# Altium schematic sheet 0095_GBIT LAN - FOXVILLE LAN PHY CHIP.SchDoc
size A3
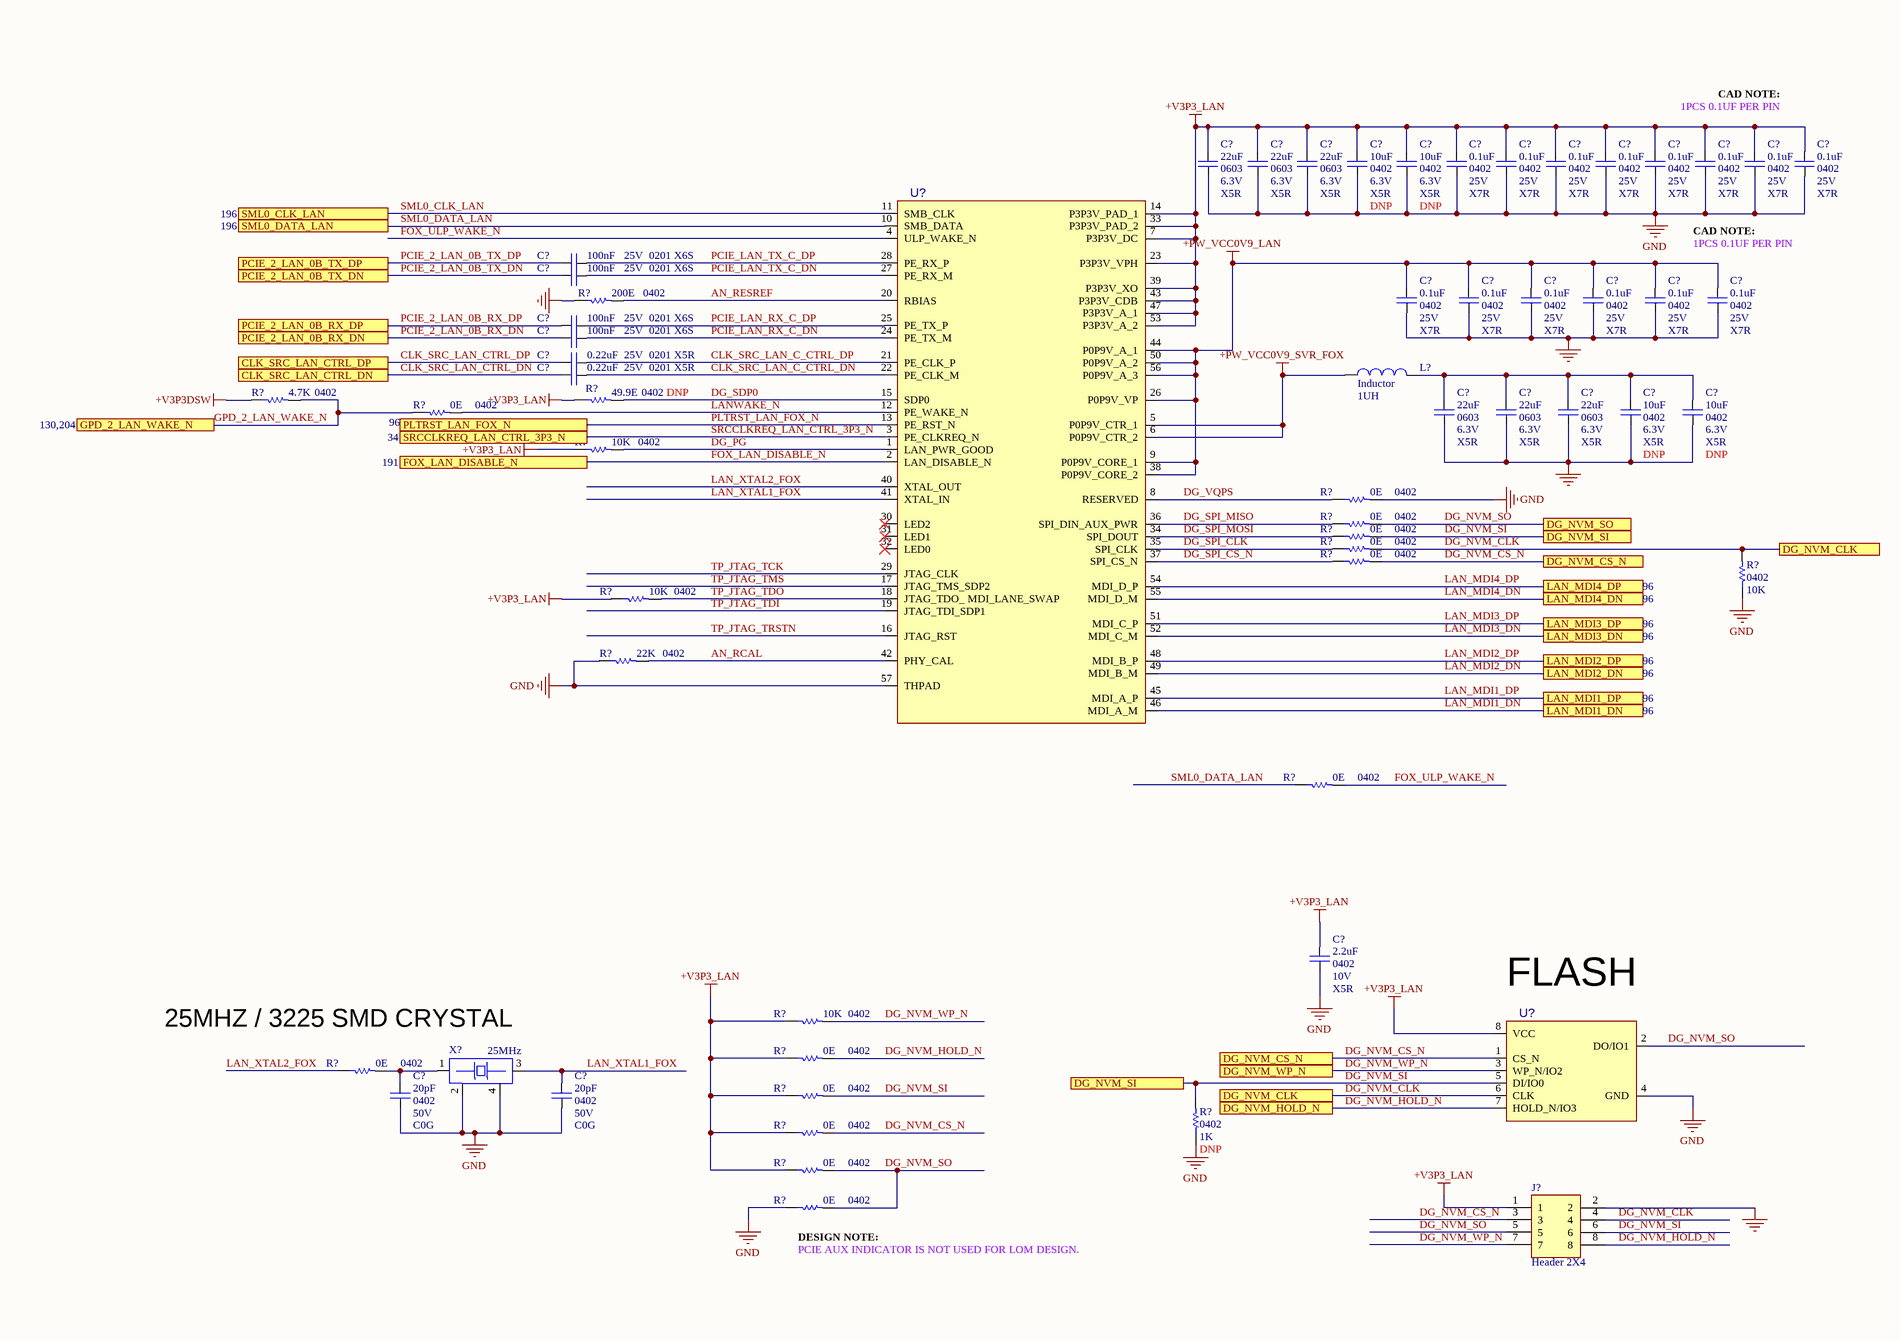
[diagram p0: 0095_GBIT LAN - FOXVILLE LAN PHY CHIP.SchDoc, bottom left]

## Parts
(Parts that share a designator on the sheet are numbered #1, #2 ... from top to bottom, then left to right.)
C?#1  value 22uF  Case/Package: 0603  Voltage: 6.3V  Dielectric: X5R  [CAPC0603]
C?#2  value 22uF  Case/Package: 0603  Voltage: 6.3V  Dielectric: X5R  [CAPC0603]
C?#3  value 22uF  Case/Package: 0603  Voltage: 6.3V  Dielectric: X5R  [CAPC0603]
C?#4  value 10uF  Case/Package: 0402  Voltage: 6.3V  Dielectric: X5R  [CAPC0402]
C?#5  value 10uF  Case/Package: 0402  Voltage: 6.3V  Dielectric: X5R  [CAPC0402]
C?#6  value 0.1uF  Case/Package: 0402  Voltage: 25V  Dielectric: X7R  [CAPC0402]
C?#7  value 0.1uF  Case/Package: 0402  Voltage: 25V  Dielectric: X7R  [CAPC0402]
C?#8  value 0.1uF  Case/Package: 0402  Voltage: 25V  Dielectric: X7R  [CAPC0402]
C?#9  value 0.1uF  Case/Package: 0402  Voltage: 25V  Dielectric: X7R  [CAPC0402]
C?#10  value 0.1uF  Case/Package: 0402  Voltage: 25V  Dielectric: X7R  [CAPC0402]
C?#11  value 0.1uF  Case/Package: 0402  Voltage: 25V  Dielectric: X7R  [CAPC0402]
C?#12  value 0.1uF  Case/Package: 0402  Voltage: 25V  Dielectric: X7R  [CAPC0402]
C?#13  value 0.1uF  Case/Package: 0402  Voltage: 25V  Dielectric: X7R  [CAPC0402]
C?#14  value 100nF  Case/Package: 0201  Voltage: 25V  Dielectric: X6S  [CAPC0201]
C?#15  value 100nF  Case/Package: 0201  Voltage: 25V  Dielectric: X6S  [CAPC0201]
C?#16  value 0.1uF  Case/Package: 0402  Voltage: 25V  Dielectric: X7R  [CAPC0402]
C?#17  value 0.1uF  Case/Package: 0402  Voltage: 25V  Dielectric: X7R  [CAPC0402]
C?#18  value 0.1uF  Case/Package: 0402  Voltage: 25V  Dielectric: X7R  [CAPC0402]
C?#19  value 0.1uF  Case/Package: 0402  Voltage: 25V  Dielectric: X7R  [CAPC0402]
C?#20  value 0.1uF  Case/Package: 0402  Voltage: 25V  Dielectric: X7R  [CAPC0402]
C?#21  value 0.1uF  Case/Package: 0402  Voltage: 25V  Dielectric: X7R  [CAPC0402]
C?#22  value 100nF  Case/Package: 0201  Voltage: 25V  Dielectric: X6S  [CAPC0201]
C?#23  value 100nF  Case/Package: 0201  Voltage: 25V  Dielectric: X6S  [CAPC0201]
C?#24  value 0.22uF  Case/Package: 0201  Voltage: 25V  Dielectric: X5R  [CAPC0201]
C?#25  value 0.22uF  Case/Package: 0201  Voltage: 25V  Dielectric: X5R  [CAPC0201]
C?#26  value 22uF  Case/Package: 0603  Voltage: 6.3V  Dielectric: X5R  [CAPC0603]
C?#27  value 22uF  Case/Package: 0603  Voltage: 6.3V  Dielectric: X5R  [CAPC0603]
C?#28  value 22uF  Case/Package: 0603  Voltage: 6.3V  Dielectric: X5R  [CAPC0603]
C?#29  value 10uF  Case/Package: 0402  Voltage: 6.3V  Dielectric: X5R  [CAPC0402]
C?#30  value 10uF  Case/Package: 0402  Voltage: 6.3V  Dielectric: X5R  [CAPC0402]
C?#31  value 2.2uF  Case/Package: 0402  Voltage: 10V  Dielectric: X5R  [CAPC0402]
C?#32  value 20pF  Case/Package: 0402  Voltage: 50V  Dielectric: C0G  [CAPC0402]
C?#33  value 20pF  Case/Package: 0402  Voltage: 50V  Dielectric: C0G  [CAPC0402]
J?  Header 2X4  [Header 2X4]
L?  Inductor  value 1UH
R?#1  value 200E  Case/Package: 0402  [RESC0402]  (hidden comment: Res)
R?#2  value 4.7K  Case/Package: 0402  [RESC0402]  (hidden comment: Res)
R?#3  value 49.9E  Case/Package: 0402  [RESC0402]  (hidden comment: Res)
R?#4  value 0E  Case/Package: 0402  [RESC0402]  (hidden comment: Res)
R?#5  value 10K  Case/Package: 0402  [RESC0402]  (hidden comment: Res)
R?#6  value 0E  Case/Package: 0402  [RESC0402]  (hidden comment: Res)
R?#7  value 0E  Case/Package: 0402  [RESC0402]  (hidden comment: Res)
R?#8  value 0E  Case/Package: 0402  [RESC0402]  (hidden comment: Res)
R?#9  value 0E  Case/Package: 0402  [RESC0402]  (hidden comment: Res)
R?#10  value 0E  Case/Package: 0402  [RESC0402]  (hidden comment: Res)
R?#11  value 10K  Case/Package: 0402  [RESC0402]  (hidden comment: Res)
R?#12  value 10K  Case/Package: 0402  [RESC0402]  (hidden comment: Res)
R?#13  value 22K  Case/Package: 0402  [RESC0402]  (hidden comment: Res)
R?#14  value 0E  Case/Package: 0402  [RESC0402]  (hidden comment: Res)
R?#15  value 10K  Case/Package: 0402  [RESC0402]  (hidden comment: Res)
R?#16  value 0E  Case/Package: 0402  [RESC0402]  (hidden comment: Res)
R?#17  value 0E  Case/Package: 0402  [RESC0402]  (hidden comment: Res)
R?#18  value 0E  Case/Package: 0402  [RESC0402]  (hidden comment: Res)
R?#19  value 1K  Case/Package: 0402  [RESC0402]  (hidden comment: Res)
R?#20  value 0E  Case/Package: 0402  [RESC0402]  (hidden comment: Res)
R?#21  value 0E  Case/Package: 0402  [RESC0402]  (hidden comment: Res)
R?#22  value 0E  Case/Package: 0402  [RESC0402]  (hidden comment: Res)
U?#1  FOXVILLE_IP  (value not drawn)
U?#2  W25Q16  (value not drawn)
X?  value 25MHz  (hidden comment: CRYSTAL_1)

## Ports
CLK_SRC_LAN_CTRL_DN, CLK_SRC_LAN_CTRL_DP, DG_NVM_CLK, DG_NVM_CS_N, DG_NVM_HOLD_N, DG_NVM_SI, DG_NVM_SO, DG_NVM_WP_N, FOX_LAN_DISABLE_N, GPD_2_LAN_WAKE_N, LAN_MDI1_DN, LAN_MDI1_DP, LAN_MDI2_DN, LAN_MDI2_DP, LAN_MDI3_DN, LAN_MDI3_DP, LAN_MDI4_DN, LAN_MDI4_DP, PCIE_2_LAN_0B_RX_DN, PCIE_2_LAN_0B_RX_DP, PCIE_2_LAN_0B_TX_DN, PCIE_2_LAN_0B_TX_DP, PLTRST_LAN_FOX_N, SML0_CLK_LAN, SML0_DATA_LAN, SRCCLKREQ_LAN_CTRL_3P3_N

## Nets
+PW_VCC0V9_LAN: C?#16.2 C?#17.2 C?#18.2 C?#19.2 C?#20.2 C?#21.2 U?#1.9(P0P9V_CORE_1) U?#1.26(P0P9V_VP) U?#1.38(P0P9V_CORE_2) U?#1.44(P0P9V_A_1) U?#1.50(P0P9V_A_2) U?#1.56(P0P9V_A_3)
+PW_VCC0V9_SVR_FOX: L?.1 U?#1.5(P0P9V_CTR_1) U?#1.6(P0P9V_CTR_2)
+V3P3_LAN: C?#1.2 C?#2.2 C?#3.2 C?#4.2 C?#5.2 C?#6.2 C?#7.2 C?#8.2 C?#9.2 C?#10.2 C?#11.2 C?#12.2 C?#13.2 C?#31.2 J?.1 R?#3.1 R?#5.1 R?#12.1 R?#15.1 R?#16.1 R?#18.1 R?#20.1 R?#21.1 U?#1.7(P3P3V_DC) U?#1.14(P3P3V_PAD_1) U?#1.23(P3P3V_VPH) U?#1.33(P3P3V_PAD_2) U?#1.39(P3P3V_XO) U?#1.43(P3P3V_CDB) U?#1.47(P3P3V_A_1) U?#1.53(P3P3V_A_2) U?#2.8(VCC)
+V3P3DSW: R?#2.1
GND: C?#1.1 C?#2.1 C?#3.1 C?#4.1 C?#5.1 C?#6.1 C?#7.1 C?#8.1 C?#9.1 C?#10.1 C?#11.1 C?#12.1 C?#13.1 C?#16.1 C?#17.1 C?#18.1 C?#19.1 C?#20.1 C?#21.1 C?#26.1 C?#27.1 C?#28.1 C?#29.1 C?#30.1 C?#31.1 C?#32.1 C?#33.1 J?.2 R?#1.1 R?#6.2 R?#11.1 R?#13.1 R?#19.1 R?#22.1 U?#1.57(THPAD) U?#2.4(GND) X?.2 X?.4
P0P9V_A_1: U?#1.44(P0P9V_A_1)
P0P9V_A_2: U?#1.50(P0P9V_A_2)
P0P9V_A_3: U?#1.56(P0P9V_A_3)
P0P9V_CORE_1: U?#1.9(P0P9V_CORE_1)
P0P9V_CORE_2: U?#1.38(P0P9V_CORE_2)
P0P9V_VP: U?#1.26(P0P9V_VP)
P3P3V_A_1: U?#1.47(P3P3V_A_1)
P3P3V_A_2: U?#1.53(P3P3V_A_2)
P3P3V_CDB: U?#1.43(P3P3V_CDB)
P3P3V_DC: U?#1.7(P3P3V_DC)
P3P3V_PAD_1: U?#1.14(P3P3V_PAD_1)
P3P3V_PAD_2: U?#1.33(P3P3V_PAD_2)
P3P3V_VPH: U?#1.23(P3P3V_VPH)
P3P3V_XO: U?#1.39(P3P3V_XO)
RESERVED: U?#1.8(RESERVED)
VCC: U?#2.8(VCC)
AN_RCAL: R?#13.2 U?#1.42(PHY_CAL)
AN_RESREF: R?#1.2 U?#1.20(RBIAS)
CLK_SRC_LAN_C_CTRL_DN: C?#25.2 U?#1.22(PE_CLK_M)
CLK_SRC_LAN_C_CTRL_DP: C?#24.2 U?#1.21(PE_CLK_P)
CLK_SRC_LAN_CTRL_DN: C?#25.1 ; port CLK_SRC_LAN_CTRL_DN
CLK_SRC_LAN_CTRL_DP: C?#24.1 ; port CLK_SRC_LAN_CTRL_DP
DG_NVM_CLK: J?.4 R?#9.2 R?#11.2 U?#2.6(CLK) ; port DG_NVM_CLK
DG_NVM_CS_N: J?.3 R?#10.2 R?#20.2 U?#2.1(CS_N) ; port DG_NVM_CS_N
DG_NVM_HOLD_N: J?.8 R?#16.2 U?#2.7(HOLD_N/IO3) ; port DG_NVM_HOLD_N
DG_NVM_SI: J?.6 R?#8.2 R?#18.2 R?#19.2 U?#2.5(DI/IO0) ; port DG_NVM_SI
DG_NVM_SO: J?.5 R?#7.2 R?#21.2 R?#22.2 U?#2.2(DO/IO1) ; port DG_NVM_SO
DG_NVM_WP_N: J?.7 R?#15.2 U?#2.3(WP_N/IO2) ; port DG_NVM_WP_N
DG_PG: R?#5.2 U?#1.1(LAN_PWR_GOOD)
DG_SDP0: R?#3.2 U?#1.15(SDP0)
DG_SPI_CLK: R?#9.1 U?#1.35(SPI_CLK)
DG_SPI_CS_N: R?#10.1 U?#1.37(SPI_CS_N)
DG_SPI_MISO: R?#7.1 U?#1.36(SPI_DIN_AUX_PWR)
DG_SPI_MOSI: R?#8.1 U?#1.34(SPI_DOUT)
DG_VQPS: R?#6.1 U?#1.8(RESERVED)
FOX_LAN_DISABLE_N: U?#1.2(LAN_DISABLE_N) ; port FOX_LAN_DISABLE_N
FOX_ULP_WAKE_N: R?#14.2 U?#1.4(ULP_WAKE_N)
GPD_2_LAN_WAKE_N: R?#2.2 R?#4.1 ; port GPD_2_LAN_WAKE_N
LAN_MDI1_DN: U?#1.46(MDI_A_M) ; port LAN_MDI1_DN
LAN_MDI1_DP: U?#1.45(MDI_A_P) ; port LAN_MDI1_DP
LAN_MDI2_DN: U?#1.49(MDI_B_M) ; port LAN_MDI2_DN
LAN_MDI2_DP: U?#1.48(MDI_B_P) ; port LAN_MDI2_DP
LAN_MDI3_DN: U?#1.52(MDI_C_M) ; port LAN_MDI3_DN
LAN_MDI3_DP: U?#1.51(MDI_C_P) ; port LAN_MDI3_DP
LAN_MDI4_DN: U?#1.55(MDI_D_M) ; port LAN_MDI4_DN
LAN_MDI4_DP: U?#1.54(MDI_D_P) ; port LAN_MDI4_DP
LAN_XTAL1_FOX: C?#33.2 U?#1.41(XTAL_IN) X?.3
LAN_XTAL2_FOX: R?#17.1 U?#1.40(XTAL_OUT)
LANWAKE_N: R?#4.2 U?#1.12(PE_WAKE_N)
PCIE_2_LAN_0B_RX_DN: C?#23.1 ; port PCIE_2_LAN_0B_RX_DN
PCIE_2_LAN_0B_RX_DP: C?#22.1 ; port PCIE_2_LAN_0B_RX_DP
PCIE_2_LAN_0B_TX_DN: C?#15.1 ; port PCIE_2_LAN_0B_TX_DN
PCIE_2_LAN_0B_TX_DP: C?#14.1 ; port PCIE_2_LAN_0B_TX_DP
PCIE_LAN_RX_C_DN: C?#23.2 U?#1.24(PE_TX_M)
PCIE_LAN_RX_C_DP: C?#22.2 U?#1.25(PE_TX_P)
PCIE_LAN_TX_C_DN: C?#15.2 U?#1.27(PE_RX_M)
PCIE_LAN_TX_C_DP: C?#14.2 U?#1.28(PE_RX_P)
PLTRST_LAN_FOX_N: U?#1.13(PE_RST_N) ; port PLTRST_LAN_FOX_N
SML0_CLK_LAN: U?#1.11(SMB_CLK) ; port SML0_CLK_LAN
SML0_DATA_LAN: R?#14.1 U?#1.10(SMB_DATA) ; port SML0_DATA_LAN
SRCCLKREQ_LAN_CTRL_3P3_N: U?#1.3(PE_CLKREQ_N) ; port SRCCLKREQ_LAN_CTRL_3P3_N
TP_JTAG_TCK: U?#1.29(JTAG_CLK)
TP_JTAG_TDI: U?#1.19(JTAG_TDI_SDP1)
TP_JTAG_TDO: R?#12.2 U?#1.18(JTAG_TDO__MDI_LANE_SWAP)
TP_JTAG_TMS: U?#1.17(JTAG_TMS_SDP2)
TP_JTAG_TRSTN: U?#1.16(JTAG_RST)
NetC?#26_2: C?#26.2 C?#27.2 C?#28.2 C?#29.2 C?#30.2 L?.2
NetC?#32_2: C?#32.2 R?#17.2 X?.1

Not connected (* = marked no-connect by the designer): U?#1 30(LED2)* 31(LED1)* 32(LED0)*

## Notes on the sheet
- (near C?#11) 1PCS 0.1UF PER PIN
- CAD NOTE:
- (near C?#21) 1PCS 0.1UF PER PIN
- (near U?#2) FLASH
- 25MHZ / 3225 SMD CRYSTAL
- (near R?#22) DESIGN NOTE:
- (near R?#22) PCIE AUX INDICATOR IS NOT USED FOR LOM DESIGN.

## Library data of the parts
C?#1-C?#3 C?#26-C?#28 = Cap: CAP CER 22uF 6.3V X5R 0603
C?#4 C?#5 C?#29 C?#30 = Cap: CAP CER 10uF 6.3V X5R 0402; DNP: DNP
C?#6-C?#13 C?#16-C?#21 = Cap: CAP CER 0.1uF 25V X7R 0402
C?#14 C?#15 C?#22 C?#23 = Cap: CAP CER 100nF 25V X6S 0201
C?#24 C?#25 = Cap: CAP CER 0.22uF 25V X5R 0201
C?#31 = Cap: CAP CER 2.2uF 10V X5R 0402
C?#32 C?#33 = Cap: CAP CER 20pF 50V C0G 0402
J? = Header 2X4: Headers & Wire Housings ECONOSTIK HEADER DR VT TH 2X4; Manufacturer Part Number: 10129381-908002BLF; Case/Package: TH
R?#1 = Res: Thick Film Resistor -  200ohm, 1%, 0402
R?#2 = Res: Thick Film Resistor -  4.7Kohm, 1%, 0402
R?#3 = Res: Thick Film Resistor -  49.9ohm, 1%, 0402; DNP: DNP
R?#4 R?#6-R?#10 R?#14 R?#16-R?#18 R?#20-R?#22 = Res: Thick Film Resistor -  0ohm, 1%, 0402
R?#5 R?#11 R?#12 R?#15 = Res: Thick Film Resistor -  10Kohm, 1%, 0402
R?#13 = Res: Thick Film Resistor -  22Kohm, 1%, 0402
R?#19 = Res: Thick Film Resistor -  1Kohm, 1%, 0402; DNP: DNP
U?#1 = FOXVILLE_IP: CDS_LMAN_SYM_OUTLINE: -500,1100,500,-1100; OriginalSymbolOrigin: (-550,1100); PACK_TYPE: ?
U?#2 = W25Q16: OriginalSymbolOrigin: (-350,250); PACK_TYPE: ?
L? = Inductor: Manufacturer Part Number: *; Case/Package: *
X? = CRYSTAL_1: Manufacturer_Part_Number: *; Case/Package: *